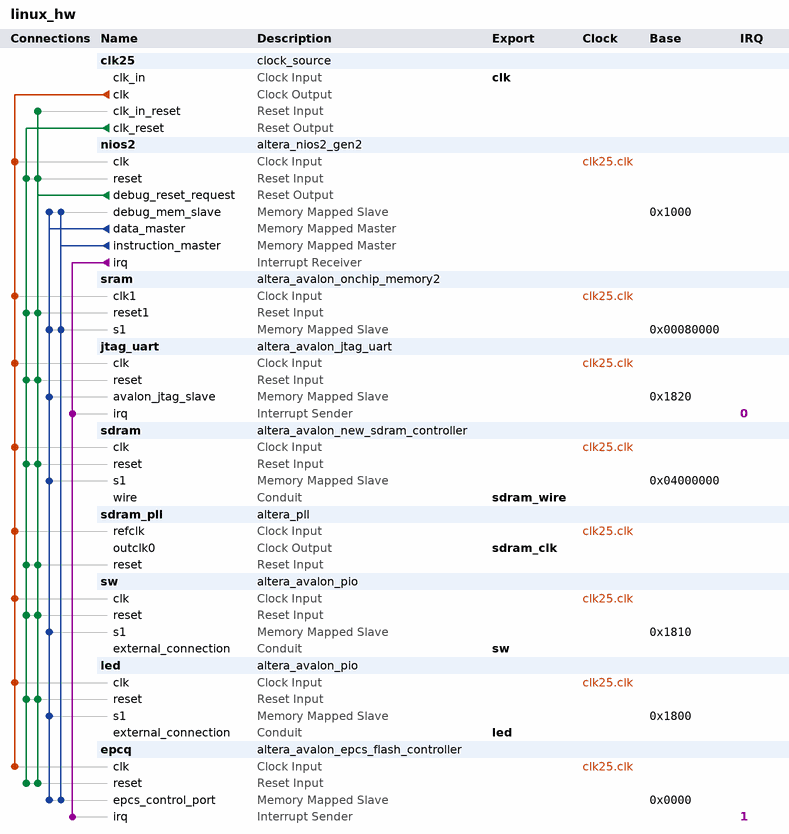
[diagram p0: system contents]
# Platform Designer (Qsys) system linux_hw, Cyclone V 5CSEMA5F31C6
# Parameters at their usual value, and those the tool derives, are not listed.
package require -exact qsys 18.1
create_system linux_hw
set_project_property DEVICE_FAMILY {Cyclone V}
set_project_property DEVICE 5CSEMA5F31C6

add_instance clk25 clock_source 18.1
set_instance_parameter_value clk25 clockFrequency 50000000

add_instance nios2 altera_nios2_gen2 18.1
set_instance_parameter_value nios2 dcache_size 2048
set_instance_parameter_value nios2 exceptionSlave epcq.epcs_control_port
set_instance_parameter_value nios2 icache_size 4096
set_instance_parameter_value nios2 impl Tiny
set_instance_parameter_value nios2 resetSlave epcq.epcs_control_port

add_instance sram altera_avalon_onchip_memory2 18.1
set_instance_parameter_value sram dataWidth 32
set_instance_parameter_value sram dualPort false
set_instance_parameter_value sram initMemContent true
set_instance_parameter_value sram initializationFileName /media/user/develop/github__docker__cyclone-v__linux-on-nios2/docker__buildroot/output/build/github__u-boot/boot_rom.hex
set_instance_parameter_value sram memorySize 262144

add_instance jtag_uart altera_avalon_jtag_uart 18.1
set_instance_parameter_value jtag_uart simInteractiveOptions NO_INTERACTIVE_WINDOWS
set_instance_parameter_value jtag_uart useRegistersForReadBuffer true
set_instance_parameter_value jtag_uart useRegistersForWriteBuffer true

add_instance sdram altera_avalon_new_sdram_controller 18.1
set_instance_parameter_value sdram TAC 5.5
set_instance_parameter_value sdram TRCD 20.0
set_instance_parameter_value sdram TRP 20.0
set_instance_parameter_value sdram casLatency 3
set_instance_parameter_value sdram columnWidth 10
set_instance_parameter_value sdram dataWidth 16
set_instance_parameter_value sdram generateSimulationModel false
set_instance_parameter_value sdram model single_Micron_MT48LC4M32B2_7_chip
set_instance_parameter_value sdram numberOfBanks 4
set_instance_parameter_value sdram numberOfChipSelects 1
set_instance_parameter_value sdram powerUpDelay 100.0
set_instance_parameter_value sdram refreshPeriod 15.625
set_instance_parameter_value sdram rowWidth 13

add_instance sdram_pll altera_pll 18.1
set_instance_parameter_value sdram_pll gui_device_speed_grade 1
set_instance_parameter_value sdram_pll gui_number_of_clocks 1
set_instance_parameter_value sdram_pll gui_operation_mode normal
set_instance_parameter_value sdram_pll gui_output_clock_frequency0 25.0
set_instance_parameter_value sdram_pll gui_phase_shift0 -3000
set_instance_parameter_value sdram_pll gui_pll_mode {Integer-N PLL}
set_instance_parameter_value sdram_pll gui_reference_clock_frequency 50.0
set_instance_parameter_value sdram_pll gui_use_locked false

add_instance sw altera_avalon_pio 18.1
set_instance_parameter_value sw direction Input
set_instance_parameter_value sw width 8

add_instance led altera_avalon_pio 18.1
set_instance_parameter_value led direction Output
set_instance_parameter_value led width 8

add_instance epcq altera_avalon_epcs_flash_controller 18.1
set_instance_parameter_value epcq resetrequest_enabled true
set_instance_parameter_value epcq useASMIAtom true

# connections
add_connection clk25.clk epcq.clk clock
add_connection clk25.clk jtag_uart.clk clock
add_connection clk25.clk led.clk clock
add_connection clk25.clk nios2.clk clock
add_connection clk25.clk sdram.clk clock
add_connection clk25.clk sdram_pll.refclk clock
add_connection clk25.clk sram.clk1 clock
add_connection clk25.clk sw.clk clock
add_connection clk25.clk_reset epcq.reset reset
add_connection clk25.clk_reset jtag_uart.reset reset
add_connection clk25.clk_reset led.reset reset
add_connection clk25.clk_reset nios2.reset reset
add_connection clk25.clk_reset sdram.reset reset
add_connection clk25.clk_reset sdram_pll.reset reset
add_connection clk25.clk_reset sram.reset1 reset
add_connection clk25.clk_reset sw.reset reset
add_connection nios2.debug_reset_request clk25.clk_in_reset reset
add_connection nios2.debug_reset_request epcq.reset reset
add_connection nios2.debug_reset_request jtag_uart.reset reset
add_connection nios2.debug_reset_request led.reset reset
add_connection nios2.debug_reset_request nios2.reset reset
add_connection nios2.debug_reset_request sdram.reset reset
add_connection nios2.debug_reset_request sdram_pll.reset reset
add_connection nios2.debug_reset_request sram.reset1 reset
add_connection nios2.debug_reset_request sw.reset reset
add_connection nios2.data_master epcq.epcs_control_port avalon
set_connection_parameter_value nios2.data_master/epcq.epcs_control_port baseAddress 0x0000
add_connection nios2.data_master jtag_uart.avalon_jtag_slave avalon
set_connection_parameter_value nios2.data_master/jtag_uart.avalon_jtag_slave baseAddress 0x1820
add_connection nios2.data_master led.s1 avalon
set_connection_parameter_value nios2.data_master/led.s1 baseAddress 0x1800
add_connection nios2.data_master nios2.debug_mem_slave avalon
set_connection_parameter_value nios2.data_master/nios2.debug_mem_slave baseAddress 0x1000
add_connection nios2.data_master sdram.s1 avalon
set_connection_parameter_value nios2.data_master/sdram.s1 baseAddress 0x04000000
add_connection nios2.data_master sram.s1 avalon
set_connection_parameter_value nios2.data_master/sram.s1 baseAddress 0x00080000
add_connection nios2.data_master sw.s1 avalon
set_connection_parameter_value nios2.data_master/sw.s1 baseAddress 0x1810
add_connection nios2.instruction_master epcq.epcs_control_port avalon
set_connection_parameter_value nios2.instruction_master/epcq.epcs_control_port baseAddress 0x0000
add_connection nios2.instruction_master nios2.debug_mem_slave avalon
set_connection_parameter_value nios2.instruction_master/nios2.debug_mem_slave baseAddress 0x1000
add_connection nios2.instruction_master sram.s1 avalon
set_connection_parameter_value nios2.instruction_master/sram.s1 baseAddress 0x00080000
add_connection nios2.irq epcq.irq interrupt
set_connection_parameter_value nios2.irq/epcq.irq irqNumber 1
add_connection nios2.irq jtag_uart.irq interrupt
set_connection_parameter_value nios2.irq/jtag_uart.irq irqNumber 0

# exported interfaces
add_interface clk clock sink
set_interface_property clk EXPORT_OF clk25.clk_in
add_interface led conduit end
set_interface_property led EXPORT_OF led.external_connection
add_interface sdram_clk clock source
set_interface_property sdram_clk EXPORT_OF sdram_pll.outclk0
add_interface sdram_wire conduit end
set_interface_property sdram_wire EXPORT_OF sdram.wire
add_interface sw conduit end
set_interface_property sw EXPORT_OF sw.external_connection

set_interconnect_requirement {$system} qsys_mm.clockCrossingAdapter AUTO
set_interconnect_requirement {$system} qsys_mm.enableEccProtection FALSE
set_interconnect_requirement {$system} qsys_mm.insertDefaultSlave FALSE
set_interconnect_requirement {$system} qsys_mm.maxAdditionalLatency 1

save_system linux_hw.qsys
